# EAGLE design ADCMP607-step-gen-BNC (EAGLE 9.6.1)
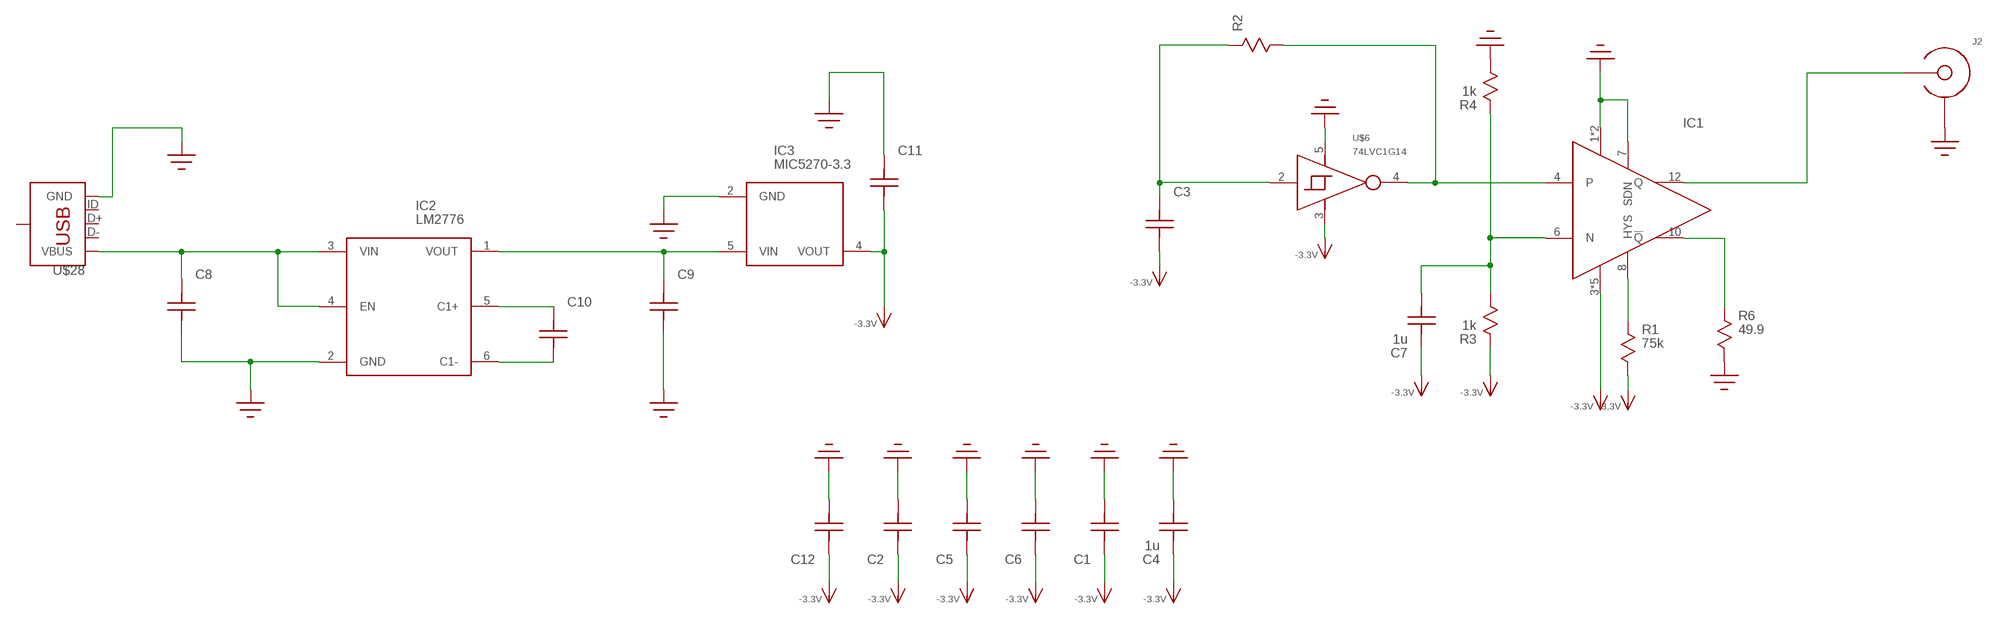
[diagram p0: schematic, sheet 1]

## Parts
C1  C0603  [C0603]
C2  C0603  [C0603]
C3  C0603  [C0603]
C4  1u  C0603  [C0603]
C5  C0603  [C0603]
C6  C0603  [C0603]
C7  1u  C0603  [C0603]
C8  C1206  [1206]
C9  C1206  [1206]
C10  C0603  [C0603]
C11  C1206  [1206]
C12  C0603  [C0603]
IC1  ADCMP607  [QFN12-3X3]
IC2  LM2776  [SOT23-6]
IC3  MIC5270-3.3  MIC5270  [SOT23-5]
J2  BNC_MALE_PCB  [BNC_MALE_PCB]
R1  75k  R0603  [R0603]
R2  R0603  [R0603]
R3  1k  R0603  [R0603]
R4  1k  R0603  [R0603]
R6  49.9  R0603  [R0603]
U$6  74LVC1G14  [SOT23-5]
U$28  USB_MICRO_LEGS  [USB_MICRO_LEGS_2]

## Nets
-3.3V: C1.P$2 C2.P$2 C3.P$1 C4.P$2 C5.P$2 C6.P$2 C7.P$2 C11.P$1 C12.P$2 IC1.3(VEE) IC1.5(VEE) IC1.9(VEE) IC1.11(VEE) IC1.EP(VEE) IC3.4(VOUT) R1.P$2 R3.P$1 U$6.3(GND)
GND: C1.P$1 C2.P$1 C4.P$1 C5.P$1 C6.P$1 C8.P$1 C9.P$1 C11.P$2 C12.P$1 IC1.1(VCC) IC1.2(VCC) IC1.7(SDN) IC2.2(GND) IC3.2(GND) J2.SHIELD@1(SHIELD) J2.SHIELD@2(SHIELD) J2.SHIELD@3(SHIELD) J2.SHIELD@4(SHIELD) R4.P$2 R6.P$2 U$6.5(VCC) U$28.GND
N$1: IC1.4(P) R2.P$2 U$6.4(OUT)
N$2: IC1.8(HYS) R1.P$1
N$3 [22-6]: IC1.12(Q) J2.CENTER
N$4: IC1.10(!Q!) R6.P$1
N$5: C3.P$2 R2.P$1 U$6.2(IN)
N$6: C7.P$1 IC1.6(N) R3.P$2 R4.P$1
N$7: C8.P$2 IC2.3(VIN) IC2.4(EN) U$28.VBUS
N$8: C10.P$2 IC2.5(C1+)
N$9: C10.P$1 IC2.6(C1-)
N$10: C9.P$2 IC2.1(VOUT) IC3.5(VIN)
Unconnected: U$28.D+ U$28.D- U$28.ID U$28.P$4(SHIELD)

## Library data of the parts
C1-C12 = yapo:C
IC1 = yapo:ADCMP607
IC2 = yapo:LM2776
IC3 = yapo:MIC5270
J2 = yapo:BNC_MALE_PCB
R1-R4 R6 = yapo:R
U$6 = yapo:74LVC1G14
U$28 = yapo:USB_MICRO_LEGS

## Net classes
1 22-6: width 0.559 mm, clearance 0.152 mm

## Board
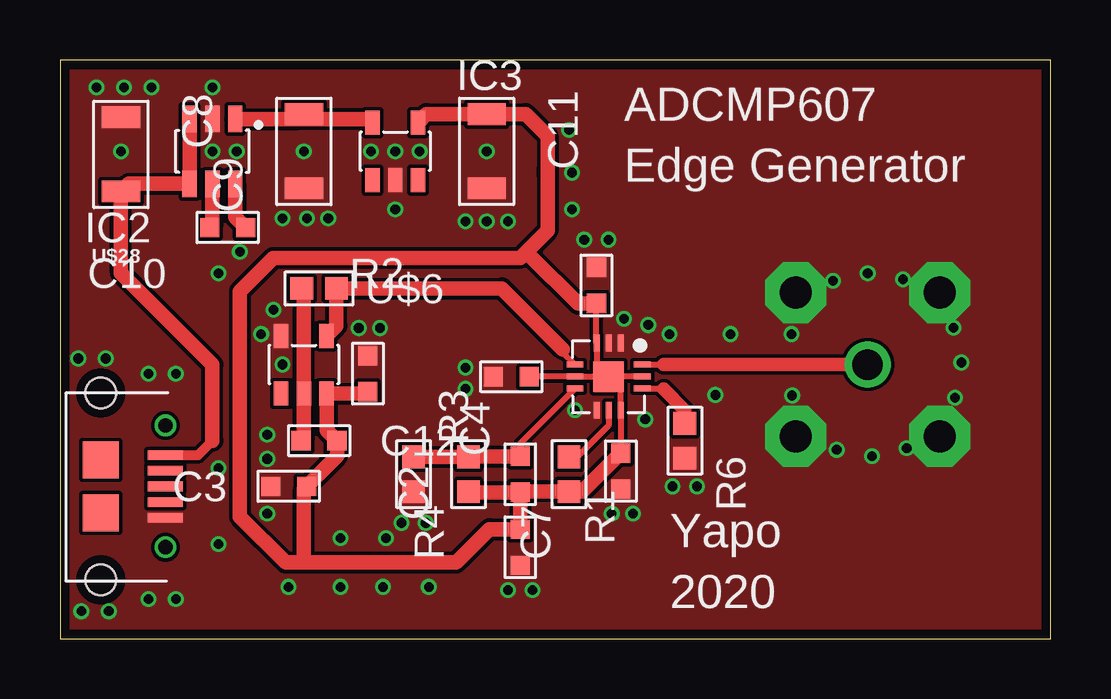
[diagram p1: board, top side]
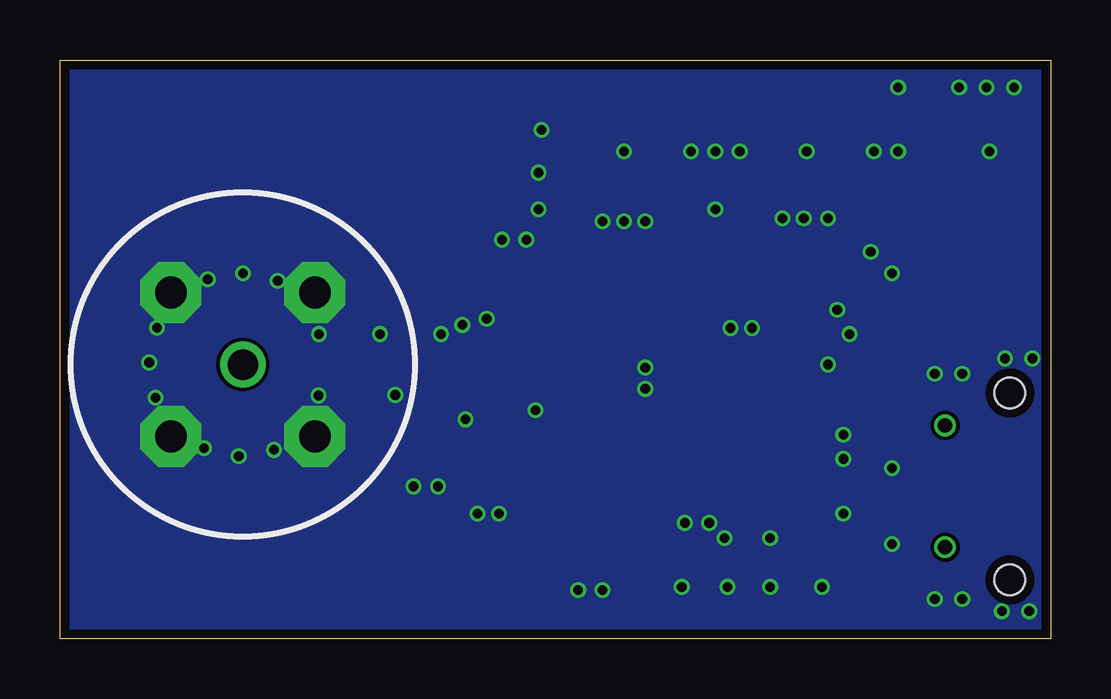
[diagram p2: board, bottom side, seen from below]

Size 41.27 x 24.13 mm. Coordinates in mm from the lower left corner, seen from the top.
Outline: 0,0 41.27,0 41.27,24.13 0,24.13 0,0
Copper layers (1*16): Top 0.035559375mm / dielectric 1.6mm / Bottom 0.035559375mm
Design rules "oshpark-2layer *": minimum track width 6mil, minimum drill 10mil, track to track 6mil, track to pad 6mil, pad to pad 6mil, via to via 6mil, smd to smd 6mil, copper to edge 15mil, drill to drill 6mil, minimum pad ring 5mil, minimum via ring 5mil, stop-mask expansion 2.5mil, vias tented up to drill 20mil, thermal gap 10mil

### Footprints (pad centres in the part's own frame; a part is rotated, then mirrored left to right if it is on the bottom)
C0603 = smd 0.8 x 0.8: P$1 -0.75,0; P$2 0.75,0
1206 = smd 0.9 x 1.6: P$1 -1.55,0; P$2 1.55,0
QFN12-3X3 = smd 0.7 x 0.25: 1 -1.4,0.5; 2 -1.4,0; 3 -1.4,-0.5; 7 1.4,-0.5; 8 1.4,0; 9 1.4,0.5 | smd 0.25 x 0.7: 4 -0.5,-1.4; 5 0,-1.4; 6 0.5,-1.4; 10 0.5,1.4; 11 0,1.4; 12 -0.5,1.4 | smd 1.27 x 1.27: EP 0,0
SOT23-6 = smd 0.6 x 1.1: 1 -0.95,-1.35; 2 0,-1.35; 3 0.95,-1.35; 4 0.95,1.35; 5 0,1.35; 6 -0.95,1.35
SOT23-5 = smd 0.6 x 1: 1 -0.95,-1.2; 2 0,-1.2; 3 0.95,-1.2; 4 0.95,1.2; 5 -0.95,1.2
BNC_MALE_PCB = drill 1.27 pad 1.676: CENTER 0,0 | drill 1.321 pad 2.54 octagon: SHIELD@1 -3,-3; SHIELD@2 -3,3; SHIELD@3 3,3; SHIELD@4 3,-3
R0603 = smd 0.95 x 0.95: P$1 -0.725,0; P$2 0.725,0
USB_MICRO_LEGS_2 = smd 0.4 x 1.45: D+ 5.08,3.745; D- 4.43,3.745; GND 6.38,3.745; ID 5.73,3.745; VBUS 3.78,3.745 | drill 0.6: P$1 2.54,3.76; P$2 7.62,3.76 | smd 1.55 x 1.5: P$3 3.98,1.06; P$4 6.18,1.06 | hole 1.27: 8.98,1.06; 1.18,1.06

### Placement (x,y rotation side)
C1  18.81,10.92 0 top
C2  12.83,11.05 270 top
C3  10.79,8.26 180 top
C4  19.18,3.81 90 top
C5  23.37,6.99 90 top
C6  22.35,14.73 270 top
C7  19.18,6.86 270 top
C8  2.54,20.19 270 top
C9  10.16,20.32 90 top
C10  6.99,17.14 180 top
C11  17.78,20.32 270 top
C12  9.53,6.35 0 top
IC1  22.86,10.92 270 top
IC2  6.35,20.32 180 top
IC3  13.97,20.32 0 top
J2  33.66,11.43 180 top
R1  21.21,6.86 270 top
R2  10.79,14.61 0 top
R3  17.02,6.86 90 top
R4  14.73,6.86 270 top
R6  26.04,8.26 270 top
U$6  10.16,11.43 0 top
U$28  0.64,11.43 270 top

### Tracks (layer width: path | path; a pad name or v marks a point on that pad's centre or on a via)
-3.3V
  Top 0.254: IC1.11 IC1.EP | IC1.EP IC1.5 C1.P$2 | IC1.EP 23.36,10.42 IC1.9 C5.P$2 | IC1.EP 22.36,11.42 IC1.3 C6.P$2
  Top 0.61: C5.P$2 21.77,6.13 R1.P$2 19.2,6.13 C7.P$2 | C7.P$2 17.04,6.11 R3.P$1 | C7.P$2 C4.P$2 17.89,4.56 16.51,3.17 10.16,3.17 | IC3.4 15.27,21.87 C11.P$1 19.41,21.87 20.32,20.95 20.32,19.56 20.32,19.34 20.32,17.02 19.18,15.88 8.89,15.88 7.49,14.48 7.49,5.08 9.4,3.17 10.16,3.17 | C2.P$2 12.76,10.23 U$6.3 11.11,8.69 C3.P$1 11.54,7.62 C12.P$2 10.16,6.24 10.16,3.17 | 19.58,15.98 21.59,13.97 C6.P$2
GND  (via drill 0.4)
  other vias: 25.4,12.7 27.94,12.7 27.3,10.16 30.48,12.7 26.54,6.35 25.53,6.35 24.38,9.14 23.5,13.34 24.51,13.08 23.88,5.21 22.99,5.21 21.46,9.53 21.84,16.64 22.86,16.64 16.89,10.41 16.89,11.3 15.24,4.83 14.22,4.83 18.67,2.03 19.68,2.03 1.52,22.99 3.81,22.99 9.27,17.53 10.29,17.53 11.18,17.53 2.67,22.99 12.45,12.95 13.34,12.95 8.38,12.7 9.27,11.43 8.89,13.72 3.68,11.05 4.83,11.05 3.68,1.65 4.83,1.65 0.76,11.68 1.91,11.68 0.89,1.14 2.03,1.14 8.64,7.49 8.64,8.51 6.6,7.11 8.64,5.21 13.46,2.16 15.37,2.16 16.89,17.4 17.78,17.4 18.67,17.4 6.35,20.32 6.35,22.99 13.97,17.91 13.97,20.32 12.95,20.32 14.99,20.32 7.37,20.32 6.6,3.94 9.53,2.16 11.68,2.16 11.68,4.19 13.59,4.19 21.34,19.43 10.16,20.32 7.49,16.13 6.6,15.24 21.34,17.91 21.21,21.21 2.54,20.32 17.78,20.32 33.66,15.24 35.12,14.98 37.23,12.97 37.55,11.51 37.3,10.05 35.28,7.94 33.83,7.62 32.36,7.87 30.51,10.14 32.2,14.92
  pour Top (rank 2, no thermals): -1.91,-1.27 42.55,-1.27 42.55,26.67 -1.91,26.67
  pour Bottom (no thermals): 43.81,-3.17 43.81,28.57 -3.81,28.57 -3.81,-3.17
N$1
  Top 0.254: IC1.4 20.95,11.93 20.95,12.06
  Top 0.61: U$6.4 11.52,13.04 R2.P$2 18.41,14.61 20.95,12.06
N$2
  Top 0.254: IC1.8 22.86,8.89 21.55,7.58 R1.P$1
N$3
  Top 0.254: IC1.12 25.15,11.43
  Top 0.559: 25.15,11.43 J2.CENTER
N$4
  Top 0.254: IC1.10 25.14,10.42 25.15,10.41
  Top 0.559: R6.P$1 26.04,9.53 25.15,10.41
N$5
  Top 0.61: C3.P$2 10.16,8.37 U$6.2 10.16,14.52 R2.P$1
N$6
  Top 0.254: IC1.6 19.18,8.14 C7.P$1
  Top 0.61: R4.P$1 R3.P$2 17.04,7.61 C7.P$1
N$7
  Top 0.406: 6.35,8.26 5.75,7.65 U$28.VBUS | 2.64,18.48 C8.P$2
  Top 0.61: 2.72,18.64 C8.P$2 2.87,18.97 IC2.4 IC2.3 | 6.35,8.26 6.35,11.43 2.54,15.24 2.54,18.38 2.64,18.48
N$8
  Top 0.61: IC2.5 6.35,17.26 C10.P$2
N$9
  Top 0.61: IC2.6 7.3,17.58 C10.P$1
N$10
  Top 0.61: IC2.1 9.96,21.67 | 9.96,21.67 C9.P$2 | IC3.5 12.87,21.67 9.96,21.67

### Text on the board
tPlace: ADCMP607 | Edge Generator | Yapo | 2020